# Altium project Project.PrjPCB
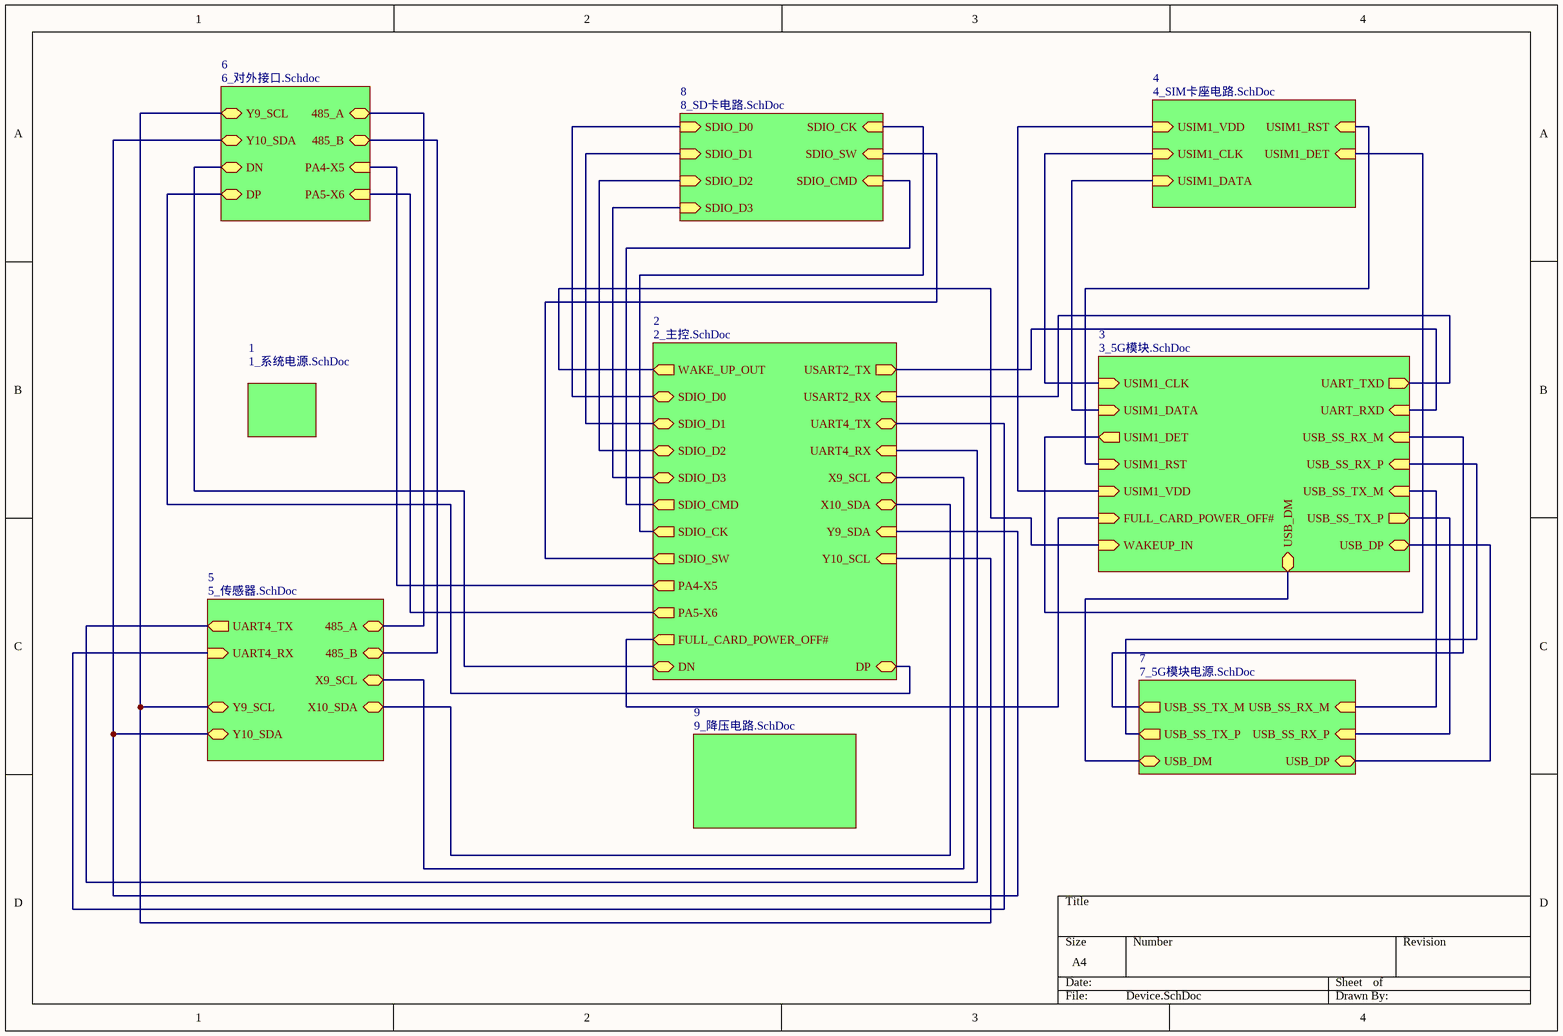
[diagram p0: Device.SchDoc]
9 sheets, 133 parts. Net scope: hierarchical (ports join the sheet entries above them; power ports are global).
Board file: PCB1.PcbDoc
Sheets:
  Device.SchDoc
    2 = 2_主控.SchDoc
    3 = 3_5G模块.SchDoc
    4 = 4_SIM卡座电路.SchDoc
    5 = 5_传感器.SchDoc
    6 = 6_对外接口.Schdoc
    7 = 7_5G模块电源.SchDoc
    8 = 8_SD卡电路.SchDoc
    9 = 9_降压电路.SchDoc

## Sheet Device.SchDoc
size A4

### Sub-sheets
1 = 1_系统电源.SchDoc (file not in this document): no entries
2 = 2_主控.SchDoc: USART2_TX (out), USART2_RX (in), UART4_TX (bidir), UART4_RX (in), X9_SCL (bidir), X10_SDA (bidir), Y9_SDA (in), Y10_SCL (in), PA4-X5 (out), PA5-X6 (out), SDIO_D0 (bidir), SDIO_D1 (bidir), SDIO_D2 (bidir), SDIO_D3 (bidir), SDIO_SW (out), SDIO_CK (out), SDIO_CMD (out), FULL_CARD_POWER_OFF# (out), WAKE_UP_OUT (out), DN (bidir), DP (bidir)
3 = 3_5G模块.SchDoc: USIM1_CLK (in), USIM1_DATA (in), USIM1_DET (out), USIM1_RST (in), USIM1_VDD (in), UART_TXD (out), UART_RXD (in), FULL_CARD_POWER_OFF# (in), USB_SS_RX_M (in), USB_SS_RX_P (in), USB_SS_TX_M (in), USB_SS_TX_P (out), WAKEUP_IN (in), USB_DP (bidir), USB_DM (bidir)
4 = 4_SIM卡座电路.SchDoc: USIM1_VDD (in), USIM1_CLK (in), USIM1_DATA (in), USIM1_RST (in), USIM1_DET (in)
5 = 5_传感器.SchDoc: UART4_TX (out), UART4_RX (in), 485_A (bidir), 485_B (bidir), X9_SCL (bidir), X10_SDA (bidir), Y9_SCL (bidir), Y10_SDA (bidir)
6 = 6_对外接口.Schdoc: Y9_SCL (bidir), Y10_SDA (bidir), 485_A (bidir), 485_B (bidir), PA4-X5 (in), PA5-X6 (in), DN (bidir), DP (bidir)
7 = 7_5G模块电源.SchDoc: USB_SS_TX_M (out), USB_SS_TX_P (out), USB_SS_RX_M (in), USB_SS_RX_P (in), USB_DM (bidir), USB_DP (bidir)
8 = 8_SD卡电路.SchDoc: SDIO_D0 (in), SDIO_D1 (in), SDIO_D2 (in), SDIO_D3 (in), SDIO_CK (in), SDIO_SW (in), SDIO_CMD (in)
9 = 9_降压电路.SchDoc: no entries

### Nets
485_A: sheet 5/485_A, sheet 6/485_A
485_B: sheet 5/485_B, sheet 6/485_B
DN: sheet 2/DN, sheet 6/DN
DP: sheet 2/DP, sheet 6/DP
FULL_CARD_POWER_OFF#: sheet 2/FULL_CARD_POWER_OFF#, sheet 3/FULL_CARD_POWER_OFF#
PA4-X5: sheet 2/PA4-X5, sheet 6/PA4-X5
PA5-X6: sheet 2/PA5-X6, sheet 6/PA5-X6
SDIO_CK: sheet 2/SDIO_CK, sheet 8/SDIO_CK
SDIO_CMD: sheet 2/SDIO_CMD, sheet 8/SDIO_CMD
SDIO_D0: sheet 2/SDIO_D0, sheet 8/SDIO_D0
SDIO_D1: sheet 2/SDIO_D1, sheet 8/SDIO_D1
SDIO_D2: sheet 2/SDIO_D2, sheet 8/SDIO_D2
SDIO_D3: sheet 2/SDIO_D3, sheet 8/SDIO_D3
SDIO_SW: sheet 2/SDIO_SW, sheet 8/SDIO_SW
UART4_RX: sheet 2/UART4_RX, sheet 5/UART4_TX
UART4_TX: sheet 2/UART4_TX, sheet 5/UART4_RX
UART_RXD: sheet 2/USART2_TX, sheet 3/UART_RXD
UART_TXD: sheet 2/USART2_RX, sheet 3/UART_TXD
USB_DM: sheet 3/USB_DM, sheet 7/USB_DM
USB_DP: sheet 3/USB_DP, sheet 7/USB_DP
USB_SS_RX_M: sheet 3/USB_SS_RX_M, sheet 7/USB_SS_TX_M
USB_SS_RX_P: sheet 3/USB_SS_RX_P, sheet 7/USB_SS_TX_P
USB_SS_TX_M: sheet 3/USB_SS_TX_M, sheet 7/USB_SS_RX_M
USB_SS_TX_P: sheet 3/USB_SS_TX_P, sheet 7/USB_SS_RX_P
USIM1_CLK: sheet 3/USIM1_CLK, sheet 4/USIM1_CLK
USIM1_DATA: sheet 3/USIM1_DATA, sheet 4/USIM1_DATA
USIM1_DET: sheet 3/USIM1_DET, sheet 4/USIM1_DET
USIM1_RST: sheet 3/USIM1_RST, sheet 4/USIM1_RST
USIM1_VDD: sheet 3/USIM1_VDD, sheet 4/USIM1_VDD
WAKE_UP_OUT: sheet 2/WAKE_UP_OUT, sheet 3/WAKEUP_IN
X9_SCL: sheet 2/X9_SCL, sheet 5/X9_SCL
X10_SDA: sheet 2/X10_SDA, sheet 5/X10_SDA
Y10_SCL: sheet 2/Y10_SCL, sheet 5/Y9_SCL, sheet 6/Y9_SCL
Y10_SDA: sheet 2/Y9_SDA, sheet 5/Y10_SDA, sheet 6/Y10_SDA

## Sheet 2_主控.SchDoc
size A3
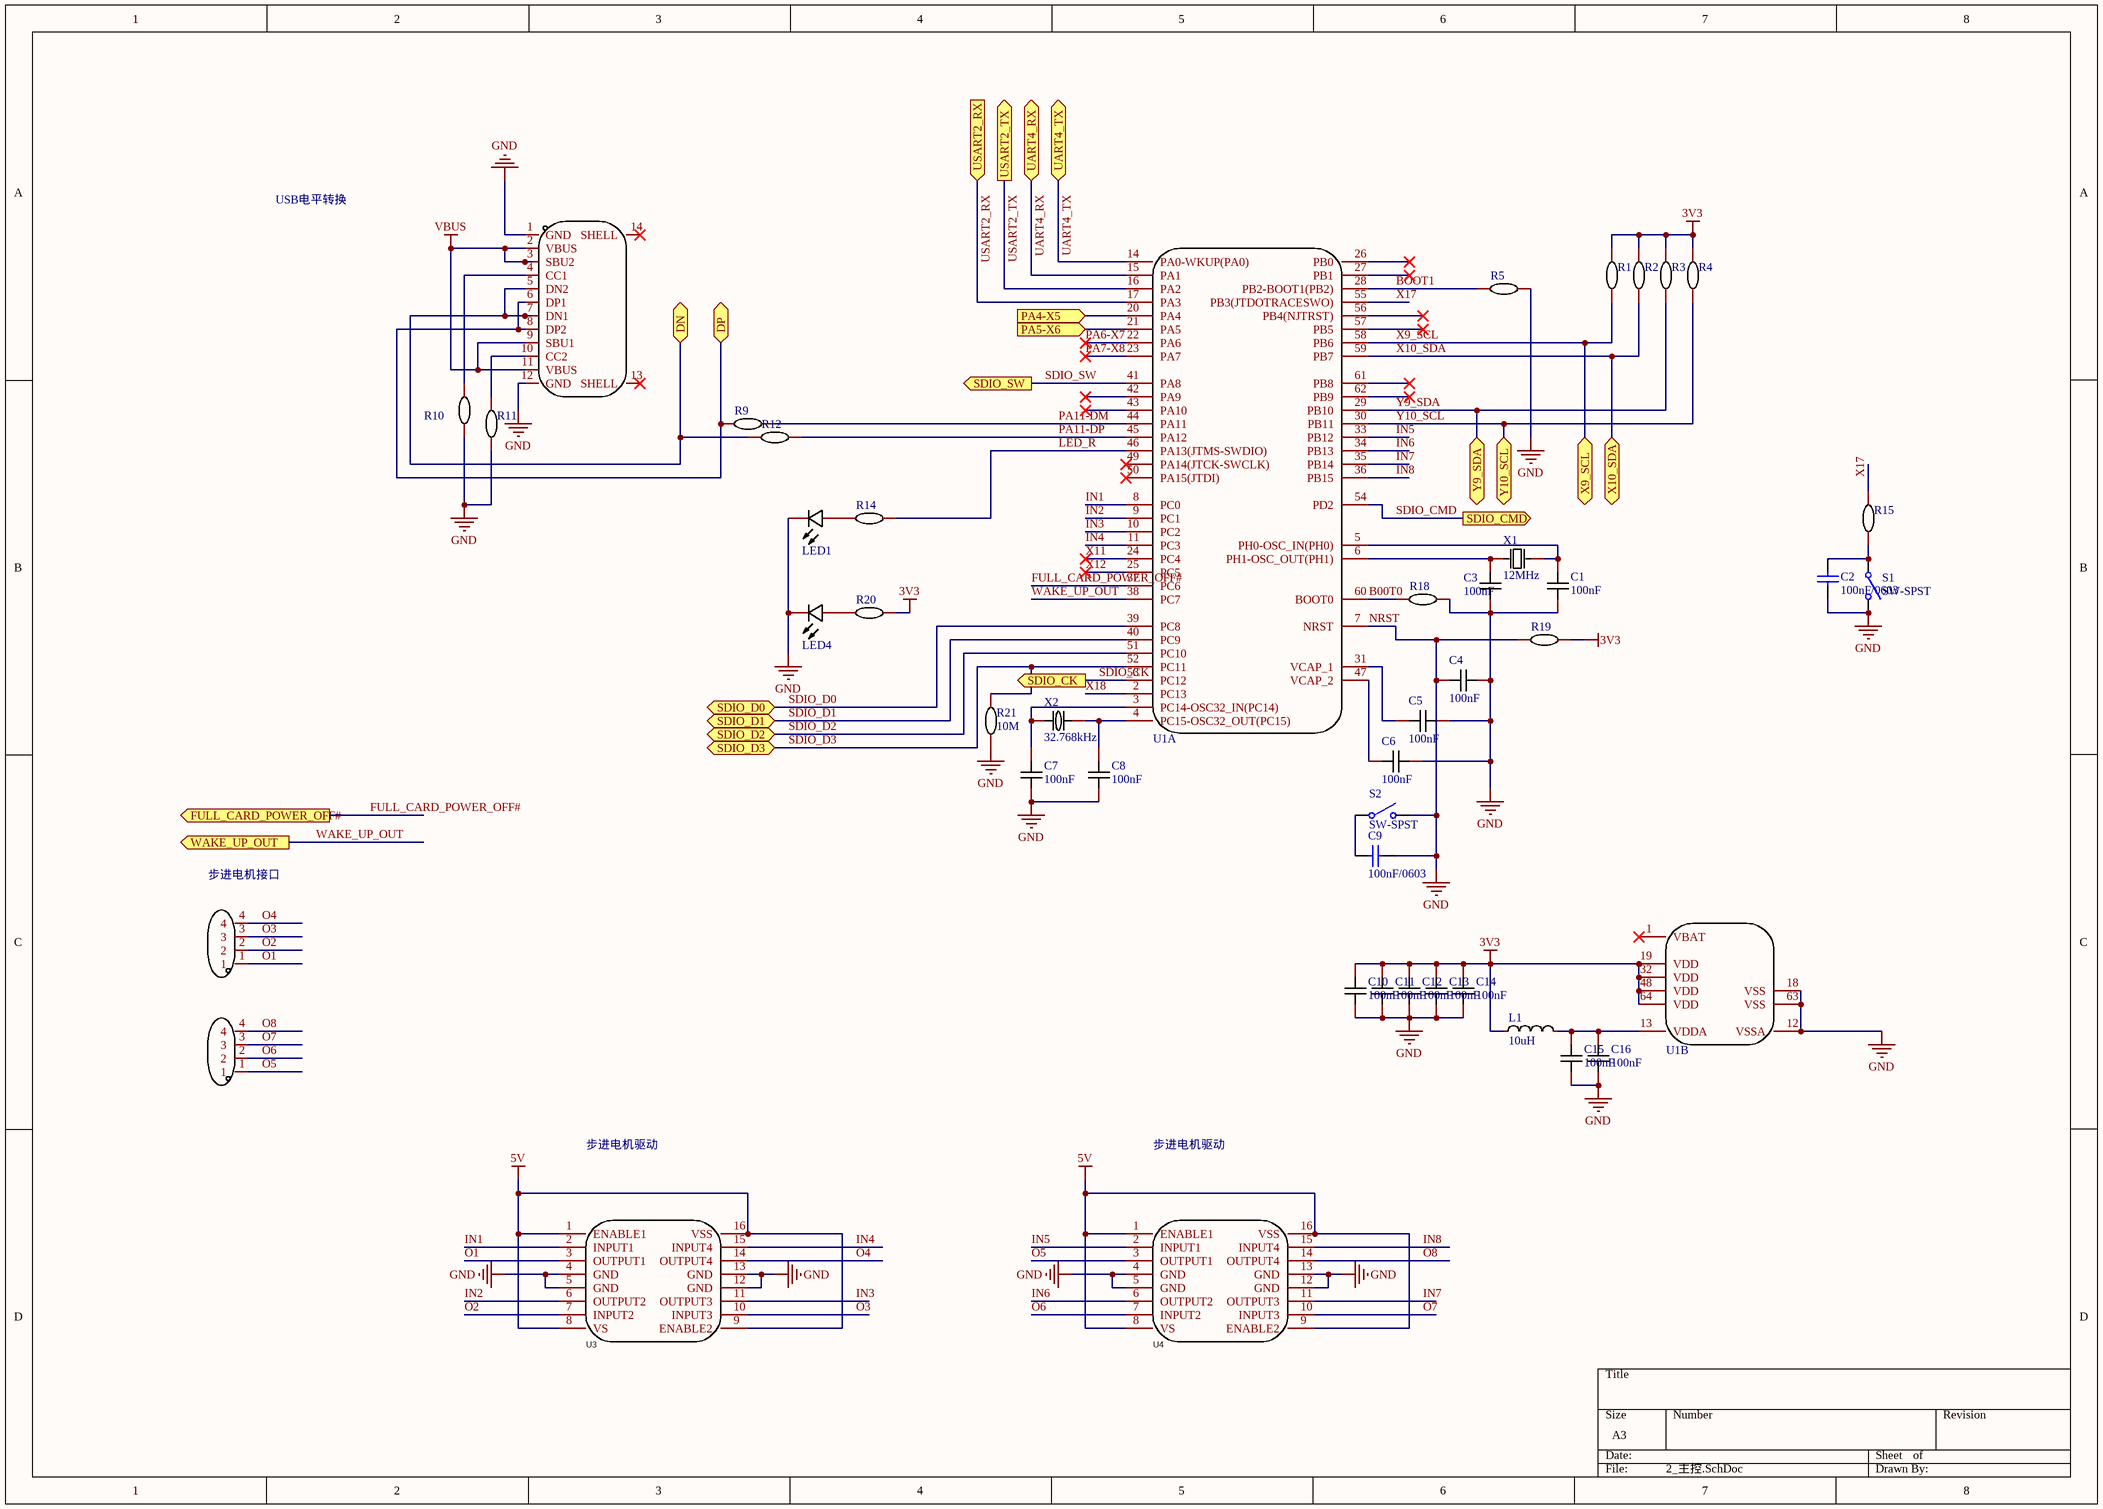
[diagram p1: 2_主控.SchDoc]

### Parts
C1  100nF  [0603C]
C2  100nF/0603  [0603C]
C3  100nF  [0603C]
C4  100nF  [0603C]
C5  100nF  [0603C]
C6  100nF  [0603C]
C7  100nF  [0603C]
C8  100nF  [0603C]
C9  100nF/0603  [0603C]
C10  100nF  [0402C]
C11  100nF  [0402C]
C12  100nF  [0402C]
C13  100nF  [0402C]
C14  100nF  [0402C]
C15  100nF  [0402C]
C16  100nF  [0402C]
CN1  HC-XHB-4A  [CONN-TH_4P-P2.50_HCTL_HC-XHB-4A]  (value not drawn)
CN2  HC-XHB-4A  [CONN-TH_4P-P2.50_HCTL_HC-XHB-4A]  (value not drawn)
L1  10uH  [L0603]
LED1  19-217/BHC-ZL1M2RY/3T  [LED0603-R-RD]  (value not drawn)
LED4  19-217/BHC-ZL1M2RY/3T  [LED0603-R-RD]  (value not drawn)
R1  (no value)  [0402R]
R2  (no value)  [0402R]
R3  (no value)  [0402R]
R4  (no value)  [0402R]
R5  (no value)  [0402R]
R9  (no value)  [0402R]
R10  (no value)  [0402R]
R11  (no value)  [0402R]
R12  (no value)  [0402R]
R14  (no value)  [0402R]
R15  (no value)  [0402R]
R18  (no value)  [0402R]
R19  (no value)  [0402R]
R20  (no value)  [0402R]
R21  10M  [0603R]
S1  SW-SPST  [SW-3x6mm-SMT]
S2  SW-SPST  [SW-3x6mm-SMT]
U1  STM32F405RGT6  [LQFP-64_L10.0-W10.0-P0.50-LS12.0-BL]  (value not drawn)  (parts A,B of 2)
U3  L293D  [SOIC-20_L13.0-W7.6-P1.27-LS10.3-BL]  (value not drawn)
U4  L293D  [SOIC-20_L13.0-W7.6-P1.27-LS10.3-BL]  (value not drawn)
USB1  TYPE-C 16PIN 2MD(073)  [USB-C-SMD_TYPE-C-6PIN-2MD-073]  (value not drawn)
X1  12MHz  [CRYSTAL-SMD_L5.0-W3.2]
X2  32.768kHz  [FC-135R_L3.2-W1.5]

### Ports
DN (bidir), DP (bidir), FULL_CARD_POWER_OFF# (out), PA4-X5 (in), PA5-X6 (in), SDIO_CK (out), SDIO_CMD (out), SDIO_D0 (bidir), SDIO_D1 (bidir), SDIO_D2 (bidir), SDIO_D3 (bidir), SDIO_SW (out), UART4_RX (bidir), UART4_TX (bidir), USART2_RX (in), USART2_TX (out), WAKE_UP_OUT (out), X9_SCL (bidir), X10_SDA (bidir), Y9_SDA (bidir), Y10_SCL (bidir)

### Nets
3V3: C10.2 C11.2 C12.2 C13.2 C14.2 L1.1 R1.2 R2.2 R3.2 R4.2 R19.1 R20.1 U1.19(VDD) U1.32(VDD) U1.48(VDD) U1.64(VDD)
5V: U3.1(ENABLE1) U3.8(VS) U3.9(ENABLE2) U3.16(VSS) U4.1(ENABLE1) U4.8(VS) U4.9(ENABLE2) U4.16(VSS)
GND: C1.1 C2.2 C3.1 C4.1 C4.2 C5.1 C6.1 C7.1 C8.1 C9.2 C10.1 C11.1 C12.1 C13.1 C14.1 C15.1 C16.1 LED1.2(C) LED4.2(C) R5.2 R10.1 R11.1 R18.1 R19.2 R21.1 S1.2(NO) S2.2(NO) U1.7(NRST) U1.12(VSSA) U1.18(VSS) U1.63(VSS) U3.4(GND) U3.5(GND) U3.12(GND) U3.13(GND) U4.4(GND) U4.5(GND) U4.12(GND) U4.13(GND) USB1.1(GND) USB1.12(GND)  [also labelled NRST]
VBUS: USB1.2(VBUS) USB1.3(SBU2) USB1.9(SBU1) USB1.11(VBUS)
B00T0: R18.2 U1.60(BOOT0)
BOOT1: R5.1 U1.28(PB2-BOOT1(PB2))
DN: R12.2 USB1.5(DN2) USB1.7(DN1) ; port DN
DP: R9.2 USB1.6(DP1) USB1.8(DP2) ; port DP
FULL_CARD_POWER_OFF#: U1.37(PC6) ; port FULL_CARD_POWER_OFF#
IN1: U1.8(PC0) U3.2(INPUT1)
IN2: U1.9(PC1) U3.6(OUTPUT2)
IN3: U1.10(PC2) U3.11(OUTPUT3)
IN4: U1.11(PC3) U3.15(INPUT4)
IN5: U1.33(PB12) U4.2(INPUT1)
IN6: U1.34(PB13) U4.6(OUTPUT2)
IN7: U1.35(PB14) U4.11(OUTPUT3)
IN8: U1.36(PB15) U4.15(INPUT4)
LED_R: R14.2 U1.46(PA13(JTMS-SWDIO))
O1: CN1.1 U3.3(OUTPUT1)
O2: CN1.2 U3.7(INPUT2)
O3: CN1.3 U3.10(INPUT3)
O4: CN1.4 U3.14(OUTPUT4)
O5: CN2.1 U4.3(OUTPUT1)
O6: CN2.2 U4.7(INPUT2)
O7: CN2.3 U4.10(INPUT3)
O8: CN2.4 U4.14(OUTPUT4)
PA4-X5: U1.20(PA4) ; port PA4-X5
PA5-X6: U1.21(PA5) ; port PA5-X6
PA6-X7: U1.22(PA6)
PA7-X8: U1.23(PA7)
PA11-DM: R9.1 U1.44(PA11)
PA11-DP: R12.1 U1.45(PA12)
SDIO_CK: U1.53(PC12) ; port SDIO_CK
SDIO_CMD: U1.54(PD2) ; port SDIO_CMD
SDIO_D0: U1.39(PC8) ; port SDIO_D0
SDIO_D1: U1.40(PC9) ; port SDIO_D1
SDIO_D2: U1.51(PC10) ; port SDIO_D2
SDIO_D3: R21.2 U1.52(PC11) ; port SDIO_D3
SDIO_SW: U1.41(PA8) ; port SDIO_SW
UART4_RX: U1.15(PA1) ; port UART4_RX
UART4_TX: U1.14(PA0-WKUP(PA0)) ; port UART4_TX
USART2_RX: U1.17(PA3) ; port USART2_RX  [project net UART_TXD]
USART2_TX: U1.16(PA2) ; port USART2_TX  [project net UART_RXD]
WAKE_UP_OUT: U1.38(PC7) ; port WAKE_UP_OUT
X9_SCL: R1.1 U1.58(PB6) ; port X9_SCL
X10_SDA: R2.1 U1.59(PB7) ; port X10_SDA
X11: U1.24(PC4)
X12: U1.25(PC5)
X17: R15.2 U1.55(PB3(JTDOTRACESWO))
X18: U1.2(PC13)
Y9_SDA: R3.1 U1.29(PB10) ; port Y9_SDA  [project net Y10_SDA]
Y10_SCL: R4.1 U1.30(PB11) ; port Y10_SCL
NetC1_2: C1.2 U1.5(PH0-OSC_IN(PH0)) X1.2(OSC2)
NetC2_1: C2.1 R15.1 S1.1(COMMON)
NetC3_2: C3.2 U1.6(PH1-OSC_OUT(PH1)) X1.1(OSC1)
NetC5_2: C5.2 U1.31(VCAP_1)
NetC6_2: C6.2 U1.47(VCAP_2)
NetC7_2: C7.2 U1.3(PC14-OSC32_IN(PC14)) X2.1
NetC8_2: C8.2 U1.4(PC15-OSC32_OUT(PC15)) X2.2
NetC9_1: C9.1 S2.1(COMMON)
NetC15_2: C15.2 C16.2 L1.2 U1.13(VDDA)
NetLED1_1: LED1.1(A) R14.1
NetLED4_1: LED4.1(A) R20.2
NetR10_2: R10.2 USB1.4(CC1)
NetR11_2: R11.2 USB1.10(CC2)

Not connected (* = marked no-connect by the designer): U1 1(VBAT)* 26(PB0)* 27(PB1)* 42(PA9)* 43(PA10)* 49(PA14(JTCK-SWCLK))* 50(PA15(JTDI))* 56(PB4(NJTRST))* 57(PB5)* 61(PB8)* 62(PB9)*; USB1 13(SHELL)* 14(SHELL)*

### Notes on the sheet
- USB电平转换
- (near CN1) 步进电机接口
- 步进电机驱动

### Library data of the parts
C1 C3-C8 C10-C16 = CAP_0603: Symbol: CapAcitance; Convert to PCB: yes; Device: CAP_0603; Add into BOM: yes; Supplier Footprint: 0603; Value: 100nF; Name: 100nF
C2 C9 = Cap: Capacitor; Value: 100pF; Published: 8-Jun-2000; LatestRevisionDate: 17-Jul-2002; LatestRevisionNote: Re-released for DXP Platform.; PackageReference: RAD-0.3; Publisher: Altium Limited; PackageDescription: Radial Cap, Thru-Hole; 2 Leads; 0.3 in Pin Spacing
CN1 CN2 = HC-XHB-4A: Add into BOM: yes; Pins Structure: 1x4P; Pitch: 2.5mm; Number of PINs Per Row: 4; Current Rating (Max): 3A; Symbol: HC-XHB-4A; Device: HC-XHB-4A; Supplier: LCSC; Supplier Part: C2845492; Manufacturer Part: HC-XHB-4A; JLCPCB Part Class: Extended Part; Datasheet: https://atta.szlcsc.com/upload/public/pdf/source/20230711/94C5BFB4D0A0F292EDF07DDE5BFB6378.pdf; Convert to PCB: yes; Row Spacing: -; Number of Pins: 4P; Number of Rows: 1; Reference Series: -
L1 = L_0603: Symbol: SDFL1608S100KTF; Add into BOM: yes; Device: L_0603; Supplier Footprint: L0603; Convert to PCB: yes; Value: 10uH; Name: 10uH
LED1 LED4 = 19-217/BHC-ZL1M2RY/3T: Add into BOM: yes; Luminous Intensity (IF=20mA): 11.5~28.5mcd@5mA; Dominant Wavelength / Coordinate rank: 465~475nm; Symbol: 19-217/BHC-ZL1M2RY/3T; Device: 19-217/BHC-ZL1M2RY/3T; Supplier Part: C72041; Manufacturer Part: 19-217/BHC-ZL1M2RY/3T; Supplier Footprint: 0603; JLCPCB Part Class: Basic Part; Datasheet: https://atta.szlcsc.com/upload/public/pdf/source/20170116/1484561237273.pdf; Supplier: LCSC; Convert to PCB: yes; Name: 19-217/BHC-ZL1M2RY/3T
R1-R5 R9-R12 R14 R15 R18-R20 = RC0402FR-0710KL: Add into BOM: yes; Power(Watts): 62.5mW; Overload Voltage (Max): 50V; Device: RC0402FR-0710KL; Supplier Part: C60490; Manufacturer Part: RC0402FR-0710KL; Supplier Footprint: 0402; JLCPCB Part Class: Extended Part; Datasheet: https://atta.szlcsc.com/upload/public/pdf/source/20170606/1496716515432.pdf; Supplier: LCSC; Convert to PCB: yes
R21 = Res_0603: Convert to PCB: yes; Device: Res_0603; Add into BOM: yes; Supplier Footprint: 0603; Value: 10M; Name: 10M
S1 S2 = SW-SPST: Single-Pole, Single-Throw Switch; Published: 24-Mar-1999; LatestRevisionDate: 17-Jul-2002; LatestRevisionNote: Re-released for DXP Platform.; PackageReference: SPST-2; Publisher: Altium Limited
U1 = STM32F405RGT6: Add into BOM: yes; CPU Core: ARM Cortex-M4; Maximum Frequency: 168MHz; Supply Voltage Range: 1.8V~3.6V; Program FLASH Size: 1MB; RAM Size: 192KB; GPIO Ports Number: 51; ADC (Units/Channels/bits): 1@x16ch/12bit; DAC (Units/Channels/bits): 1@x2ch/12bit; Symbol: STM32F405RGT6; Device: STM32F405RGT6; Supplier Part: C15742; Manufacturer Part: STM32F405RGT6; Supplier Footprint: LQFP-64(10x10); JLCPCB Part Class: Extended Part; Datasheet: https://atta.szlcsc.com/upload/public/pdf/source/20140724/1457707160365.pdf; Supplier: LCSC; Convert to PCB: yes; EEPROM/Data FLASH Size: -; Name: STM32F405RGT6
U3 U4 = L293D: Add into BOM: yes; Supply Voltage: 4.5V~36V; Output Current: 600mA; Symbol: L293D; Device: L293D; Supplier Part: C12340; Manufacturer Part: L293D; Supplier Footprint: DIP-16; JLCPCB Part Class: Extended Part; Datasheet: https://atta.szlcsc.com/upload/public/pdf/source/20140724/1457707157802.pdf; Supplier: LCSC; Convert to PCB: yes
USB1 = TYPE-C 16PIN 2MD(073): Add into BOM: yes; Number of Ports: 1; Number of Contacts: 16P; Current Rating - Power (Max): 5A; Symbol: TYPE-C 16PIN 2MD(073); Device: TYPE-C 16PIN 2MD(073); Supplier: LCSC; Supplier Part: C2765186; Manufacturer Part: TYPE-C 16PIN 2MD(073); JLCPCB Part Class: Extended Part; Supplier Footprint: SMD; Datasheet: https://atta.szlcsc.com/upload/public/pdf/source/20211123/39B17C16241EAC15C5E277BDA434118E.pdf; Convert to PCB: yes; Connector Type: Type-C; Standard: -
X1 = X50328MSB2GI: Add into BOM: yes; Load Capacitance: 20pF; Symbol: X50328MSB2GI; Device: X50328MSB2GI; Supplier Part: C115962; Manufacturer Part: X50328MSB2GI; Supplier Footprint: SMD5032-2P; JLCPCB Part Class: Basic Part; Datasheet: https://atta.szlcsc.com/upload/public/pdf/source/20230220/0EBFFB9D6D8CE6A211407822BBB6C516.pdf; Supplier: LCSC; Convert to PCB: yes; Value: 12MHz; Name: 12MHz
X2 = Q13FC1350000400: Add into BOM: yes; Load Capacitance: 12.5pF; Symbol: Q13FC1350000400; Device: Q13FC1350000400; Supplier Part: C32346; Manufacturer Part: Q13FC1350000400; Supplier Footprint: SMD3215-2P; JLCPCB Part Class: Basic Part; Datasheet: https://atta.szlcsc.com/upload/public/pdf/source/20190108/C32346_746D6B07EAF90824457A96480007685F.pdf; Supplier: LCSC; Convert to PCB: yes; Value: 32.768kHz; Name: 32.768kHz

## Sheet 3_5G模块.SchDoc
size A4
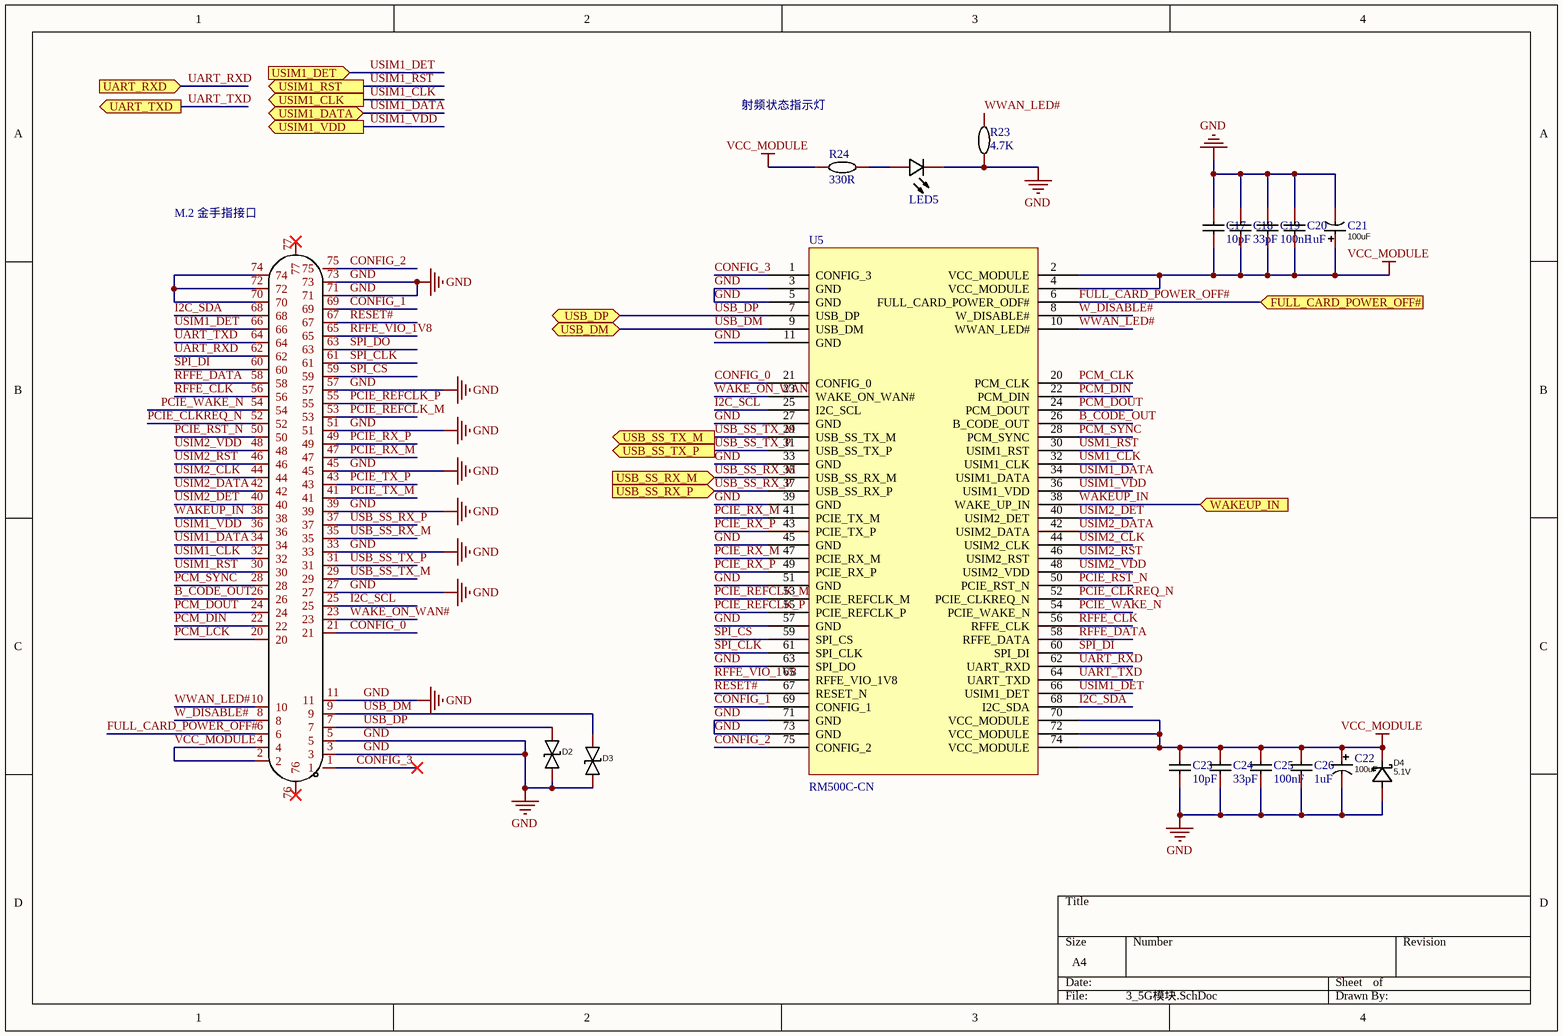
[diagram p2: 3_5G模块.SchDoc]

### Parts
C17  Name: 10pF  [0603C]  (hidden comment: 100nF)
C18  Name: 33pF  [0603C]  (hidden comment: 100nF)
C19  100nF  [0603C]
C20  Name: 1uF  [0603C]  (hidden comment: 100nF)
C21  100uF  [1206C]
C22  100uF  [1206C]
C23  Name: 10pF  [0603C]  (hidden comment: 100nF)
C24  Name: 33pF  [0603C]  (hidden comment: 100nF)
C25  100nF  [0603C]
C26  Name: 1uF  [0603C]  (hidden comment: 100nF)
CN3  APCI0078-P002A_C7498136  [NGFF-SMD_APCI0078-P002A]  (value not drawn)
D2  PESD3V3L1BA-N  [SOD-323_L1.8-W1.3-LS2.5-BI]  (value not drawn)
D3  PESD3V3L1BA-N  [SOD-323_L1.8-W1.3-LS2.5-BI]  (value not drawn)
D4  Reverse Stand-Off Voltage (Vrwm): 5.1V  [SOD-123FL_L2.8-W1.8-LS3.7-RD]  (hidden comment: SMF75A_C5116416)
LED5  NCD0603G1  [LED0603-RD]  (value not drawn)
R23  4.7K  [0603R]
R24  330R  [0402R]
U5  RM500C-CN

### Ports
FULL_CARD_POWER_OFF# (in), UART_RXD (in), UART_TXD (out), USB_DM (bidir), USB_DP (bidir), USB_SS_RX_M (in), USB_SS_RX_P (in), USB_SS_TX_M (out), USB_SS_TX_P (out), USIM1_CLK (out), USIM1_DATA (bidir), USIM1_DET (in), USIM1_RST (out), USIM1_VDD (out), WAKEUP_IN (in)

### Nets
GND: C17.1 C18.1 C19.1 C20.1 C21.2 C22.2 C23.1 C24.1 C25.1 C26.1 CN3.3 CN3.5 CN3.11 CN3.27 CN3.33 CN3.39 CN3.45 CN3.51 CN3.57 CN3.71 CN3.73 D2.1 D3.1 D4.2(A) LED5.1(C) R23.1 U5.3(GND) U5.5(GND) U5.11(GND) U5.27(GND) U5.33(GND) U5.39(GND) U5.45(GND) U5.51(GND) U5.57(GND) U5.63(SPI_DO) U5.71(GND) U5.73(GND)
VCC_MODULE: C17.2 C18.2 C19.2 C20.2 C21.1 C22.1 C23.2 C24.2 C25.2 C26.2 CN3.2 CN3.4 D4.1(K) R24.1 U5.2(VCC_MODULE) U5.4(VCC_MODULE) U5.70(VCC_MODULE) U5.72(VCC_MODULE) U5.74(VCC_MODULE)
B_CODE_OUT: CN3.26 U5.26(B_CODE_OUT)
CONFIG_0: CN3.21 U5.21(CONFIG_0)
CONFIG_1: CN3.69 U5.69(CONFIG_1)
CONFIG_2: CN3.75 U5.75(CONFIG_2)
CONFIG_3: CN3.1 U5.1(CONFIG_3)
FULL_CARD_POWER_OFF#: CN3.6 U5.6(FULL_CARD_POWER_ODF#) ; port FULL_CARD_POWER_OFF#
I2C_SCL: CN3.25 U5.25(I2C_SCL)
I2C_SDA: CN3.68 U5.68(I2C_SDA)
PCIE_CLKREQ_N: CN3.52 U5.52(PCIE_CLKREQ_N)
PCIE_REFCLK_M: CN3.53 U5.53(PCIE_REFCLK_M)
PCIE_REFCLK_P: CN3.55 U5.55(PCIE_REFCLK_P)
PCIE_RST_N: CN3.50 U5.50(PCIE_RST_N)
PCIE_RX_M: CN3.47 U5.41(PCIE_TX_M) U5.47(PCIE_RX_M)
PCIE_RX_P: CN3.49 U5.43(PCIE_TX_P) U5.49(PCIE_RX_P)
PCIE_TX_M: CN3.41
PCIE_TX_P: CN3.43
PCIE_WAKE_N: CN3.54 U5.54(PCIE_WAKE_N)
PCM_CLK: U5.20(PCM_CLK)
PCM_DIN: CN3.22 U5.22(PCM_DIN)
PCM_DOUT: CN3.24 U5.24(PCM_DOUT)
PCM_LCK: CN3.20
PCM_SYNC: CN3.28 U5.28(PCM_SYNC)
RESET#: CN3.67 U5.67(RESET_N)
RFFE_CLK: CN3.56 U5.56(RFFE_CLK)
RFFE_DATA: CN3.58 U5.58(RFFE_DATA)
RFFE_VIO_1V8: CN3.65 U5.65(RFFE_VIO_1V8)
SPI_CLK: CN3.61 U5.61(SPI_CLK)
SPI_CS: CN3.59 U5.59(SPI_CS)
SPI_DI: CN3.60 U5.60(SPI_DI)
SPI_DO: CN3.63
UART_RXD: CN3.62 U5.62(UART_RXD) ; port UART_RXD
UART_TXD: CN3.64 U5.64(UART_TXD) ; port UART_TXD
USB_DM: CN3.9 D3.2 U5.9(USB_DM) ; port USB_DM
USB_DP: CN3.7 D2.2 U5.7(USB_DP) ; port USB_DP
USB_SS_RX_M: CN3.35 U5.35(USB_SS_RX_M) ; port USB_SS_RX_M
USB_SS_RX_P: CN3.37 U5.37(USB_SS_RX_P) ; port USB_SS_RX_P
USB_SS_TX_M: CN3.29 U5.29(USB_SS_TX_M) ; port USB_SS_TX_M
USB_SS_TX_P: CN3.31 U5.31(USB_SS_TX_P) ; port USB_SS_TX_P
USIM1_CLK: CN3.32 ; port USIM1_CLK
USIM1_DATA: CN3.34 U5.34(USIM1_DATA) ; port USIM1_DATA
USIM1_DET: CN3.66 U5.66(USIM1_DET) ; port USIM1_DET
USIM1_RST: CN3.30 ; port USIM1_RST
USIM1_VDD: CN3.36 U5.36(USIM1_VDD) ; port USIM1_VDD
USIM2_CLK: CN3.44 U5.44(USIM2_CLK)
USIM2_DATA: CN3.42 U5.42(USIM2_DATA)
USIM2_DET: CN3.40 U5.40(USIM2_DET)
USIM2_RST: CN3.46 U5.46(USIM2_RST)
USIM2_VDD: CN3.48 U5.48(USIM2_VDD)
USM1_CLK: U5.32(USIM1_CLK)
USM1_RST: U5.30(USIM1_RST)
W_DISABLE#: CN3.8 U5.8(W_DISABLE#)
WAKE_ON_WAN#: CN3.23 U5.23(WAKE_ON_WAN#)
WAKEUP_IN: CN3.38 U5.38(WAKE_UP_IN) ; port WAKEUP_IN  [project net WAKE_UP_OUT]
WWAN_LED#: CN3.10 R23.2 U5.10(WWAN_LED#)
NetCN3_70: CN3.70 CN3.72 CN3.74
NetLED5_2: LED5.2(A) R24.2

Not connected (* = marked no-connect by the designer): CN3 76* 77*

### Notes on the sheet
- 射频状态指示灯
- (near CN3) M.2 金手指接口

### Library data of the parts
C17-C20 C23-C26 = 0603B104K500NT: Manufacturer: FH; Convert to PCB: yes; Origin Footprint: C0603; Symbol: 100nF; Device: 0603B104K500NT; Supplier: LCSC; Manufacturer Part: 0603B104K500NT; Supplier Part: C30926; JLCPCB Part Class: Extended Part; Add into BOM: yes
  C19 C25: Name: 100nF
C21 C22 = CL31A226KAHNNNE: Symbol: 22uF; Add into BOM: yes; Temperature Coefficient: X5R; Voltage Rated: 25V; Origin Footprint: CAP-TH_BD4.0-P1.50-D0.8-FD; Device: CL31A226KAHNNNE; Supplier Part: C12891; Manufacturer Part: CL31A226KAHNNNE; Supplier Footprint: 1206; JLCPCB Part Class: Extended Part; Datasheet: https://atta.szlcsc.com/upload/public/pdf/source/20160103/1457707667836.pdf; Supplier: LCSC; Convert to PCB: yes; Value: 100uF
CN3 = APCI0078-P002A_C7498136: Add into BOM: yes; Connector Type: M.2; Pitch: 0.5mm; Symbol: APCI0078-P002A_C7498136; Device: APCI0078-P002A_C7498136; Supplier: LCSC; Supplier Part: C7498136; Manufacturer Part: APCI0078-P002A; JLCPCB Part Class: Extended Part; Datasheet: https://atta.szlcsc.com/upload/public/pdf/source/20230918/968CC5EFA479112182B1AF662CC27BAA.pdf; Convert to PCB: yes; Number of Pins: 67P; Height Above Board: 3.2mm
D2 D3 = PESD3V3L1BA-N: Add into BOM: yes; Symbol: PESD3V3L1BA-N; Device: PESD3V3L1BA-N; Supplier: LCSC; Supplier Part: C316020; Manufacturer Part: PESD3V3L1BA-N; JLCPCB Part Class: Extended Part; LCSC Part Name: PESD3V3L1BA-N; Supplier Footprint: SOD-323; Datasheet: https://atta.szlcsc.com/upload/public/pdf/source/20181025/C316020_2B145715011D530A3B5DDCE0F9684BA2.pdf; Convert to PCB: yes
D4 = SMF75A_C5116416: Manufacturer Part: SMF75A; Add into BOM: yes; Maximum Clamping Voltage: 121V; Peak Pulse Current (Ipp)@10/1000us: 1.4A; Peak Pulse Power Dissipation (Ppp)@10/1000us: 200W; Breakdown Voltage: 92.1V; Reverse Leakage Current (Ir): 1uA; Symbol: SMF75A_C5116416; Device: SMF75A_C5116416; Supplier Part: C5116416; Supplier Footprint: SOD-123FL; JLCPCB Part Class: Extended Part; Datasheet: https://atta.szlcsc.com/upload/public/pdf/source/20220715/82D6503F9C43F0DF9BB8970EC229759F.pdf; Convert to PCB: yes
LED5 = NCD0603G1: Symbol: 19-217/GHC-YR1S2/3T; Add into BOM: yes; Luminous Intensity (IF=20mA): 300~900mcd@10mA; Dominant Wavelength / Coordinate rank: 515~530nm; Dominant Wavelength: 520nm~535nm; Peak Wavelength: 518nm; Forward Current: 20mA; Power Dissipation: 110mW; Device: NCD0603G1; Supplier Part: C84267; Manufacturer Part: NCD0603G1; Supplier Footprint: 0603; JLCPCB Part Class: Extended Part; Datasheet: https://atta.szlcsc.com/upload/public/pdf/source/20200820/C84267_04BA7703640BAC111D09F5EFB971FBF3.pdf; Supplier: LCSC; Convert to PCB: yes; Correlated Color Temperature - CCT(K): -; Luminous Flux/Radiant Flux: -; Diode Configuration: -; Color Temperature: -; Mounting Sytle: -; Name: NCD0603G1
R23 = RMC06034.7k5%N: Manufacturer: Tyohm; Convert to PCB: yes; Origin Footprint: R0603; Symbol: 4.7K; Device: RMC06034.7k5%N; Supplier: LCSC; Supplier Part: C269694; Manufacturer Part: RMC06034.7k5%N; JLCPCB Part Class: Extended Part; Add into BOM: yes; Name: 4.7K
R24 = 0402WGF1001TCE: Add into BOM: yes; Power(Watts): 62.5mW; Overload Voltage (Max): 50V; Device: 0402WGF1001TCE; Manufacturer Part: 0402WGF1001TCE; Supplier Footprint: 0402; JLCPCB Part Class: Basic Part; Datasheet: https://atta.szlcsc.com/upload/public/pdf/source/20200306/C422600_1E6D84923E4A46A82E41ADD87F860B5C.pdf; Supplier: LCSC; Convert to PCB: yes
U5 = RM500C: id: U?; 注释: RM500C-CN

## Sheet 4_SIM卡座电路.SchDoc
size A4
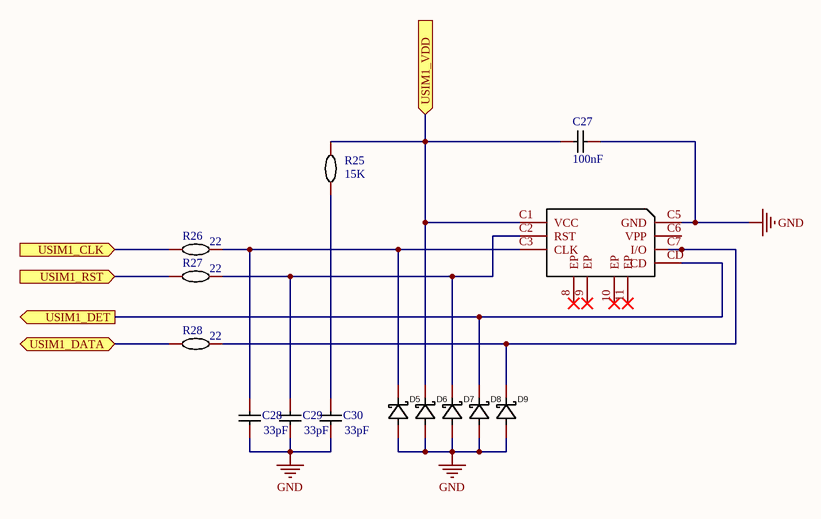
[diagram p3: 4_SIM卡座电路.SchDoc]

### Parts
C27  100nF  [0603C]
C28  33pF  [0402C]
C29  33pF  [0402C]
C30  33pF  [0402C]
CARD1  SMN-303  [SIM-SMD_SMN-303]  (value not drawn)
D5  (no value)  [SOD-123FL_L2.8-W1.8-LS3.7-RD]
D6  (no value)  [SOD-123FL_L2.8-W1.8-LS3.7-RD]
D7  (no value)  [SOD-123FL_L2.8-W1.8-LS3.7-RD]
D8  (no value)  [SOD-123FL_L2.8-W1.8-LS3.7-RD]
D9  (no value)  [SOD-123FL_L2.8-W1.8-LS3.7-RD]
R25  Name: 15K  [0603R]  (hidden comment: 4.7K)
R26  22  [0402R]
R27  22  [0402R]
R28  22  [0402R]

### Ports
USIM1_CLK (in), USIM1_DATA (bidir), USIM1_DET (out), USIM1_RST (in), USIM1_VDD (in)

### Nets
GND: C27.1 C28.1 C29.1 C30.1 CARD1.C5(GND) D5.2(A) D6.2(A) D7.2(A) D8.2(A) D9.2(A)
USIM1_CLK: R26.1 ; port USIM1_CLK
USIM1_DATA: R28.1 ; port USIM1_DATA
USIM1_DET: CARD1.CD D8.1(K) ; port USIM1_DET
USIM1_RST: R27.1 ; port USIM1_RST
USIM1_VDD: C27.2 CARD1.C1(VCC) D6.1(K) R25.2 ; port USIM1_VDD
NetC28_2: C28.2 CARD1.C3(CLK) D5.1(K) R26.2
NetC29_2: C29.2 CARD1.C2(RST) D7.1(K) R27.2
NetC30_2: C30.2 R25.1
NetCARD1_C7: CARD1.C7(I/O) D9.1(K) R28.2

Not connected (* = marked no-connect by the designer): CARD1 8(EP)* 9(EP)* 10(EP)* 11(EP)* C6(VPP)

### Library data of the parts
C27-C30 = CL31A106KBHNNNE: Add into BOM: yes; Value: 10uF; Voltage Rated: 50V; Temperature Coefficient: X5R; Symbol: CL31A106KBHNNNE; Device: CL31A106KBHNNNE; Supplier Part: C13585; Manufacturer Part: CL31A106KBHNNNE; Supplier Footprint: 1206; JLCPCB Part Class: Basic Part; Datasheet: https://atta.szlcsc.com/upload/public/pdf/source/20160103/1457707668742.pdf; Supplier: LCSC; Convert to PCB: yes; Name: 10uF
CARD1 = SMN-303: Add into BOM: yes; Body Height (Max): 1.37mm; Symbol: SMN-303; Device: SMN-303; Supplier: LCSC; Supplier Part: C266888; Manufacturer Part: SMN-303; JLCPCB Part Class: Extended Part; Supplier Footprint: SMD; Datasheet: https://atta.szlcsc.com/upload/public/pdf/source/20230608/69FA23A73293DEADC31E393DD83871F4.pdf; Convert to PCB: yes; Contact Material: C5191
D5-D9 = SMF75A_C5116416: Manufacturer Part: SMF75A; Add into BOM: yes; Reverse Stand-Off Voltage (Vrwm): 75V; Maximum Clamping Voltage: 121V; Peak Pulse Current (Ipp)@10/1000us: 1.4A; Peak Pulse Power Dissipation (Ppp)@10/1000us: 200W; Breakdown Voltage: 92.1V; Reverse Leakage Current (Ir): 1uA; Symbol: SMF75A_C5116416; Device: SMF75A_C5116416; Supplier: LCSC; Supplier Part: C5116416; Supplier Footprint: SOD-123FL; JLCPCB Part Class: Extended Part; Datasheet: https://atta.szlcsc.com/upload/public/pdf/source/20220715/82D6503F9C43F0DF9BB8970EC229759F.pdf; Convert to PCB: yes
R25 = RMC06034.7k5%N: as R23 on sheet 3_5G模块; Symbol: 4.7K; Device: RMC06034.7k5%N; Supplier: LCSC; Supplier Part: C269694; Manufacturer Part: RMC06034.7k5%N; JLCPCB Part Class: Extended Part; Add into BOM: yes
R26-R28 = Res_0402: Convert to PCB: yes; Value: 20; Device: Res_0402; Add into BOM: yes; Supplier Footprint: 0402; Name: 20

## Sheet 5_传感器.SchDoc
size A4
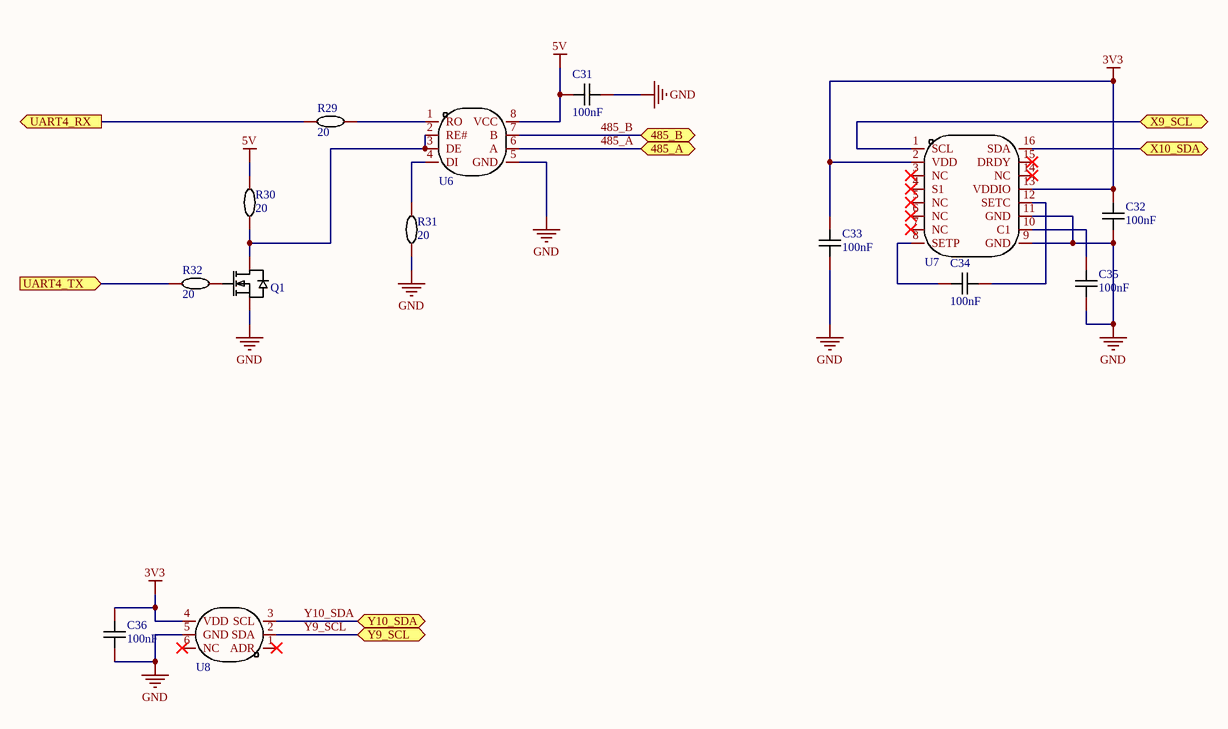
[diagram p4: 5_传感器.SchDoc]

### Parts
C31  100nF  [0402C]
C32  100nF  [0402C]
C33  100nF  [0402C]
C34  100nF  [0402C]
C35  100nF  [0402C]
C36  100nF  [0402C]
Q1  2N7002  [SOT-23-3_L2.9-W1.3-P1.90-LS2.4-BR]  (value not drawn)
R29  20  [0402R]
R30  20  [0402R]
R31  20  [0402R]
R32  20  [0402R]
U6  MAX3485ECSA+  [SOIC-8_L4.9-W3.9-P1.27-LS6.0-BL]  (value not drawn)
U7  QMC5883L  [LGA-16_L3.0-W3.0-P0.50-BL_SQ]  (value not drawn)
U8  AHT10  [SENSOR-SMD_AHT10]  (value not drawn)

### Ports
485_A (bidir), 485_B (bidir), UART4_RX (out), UART4_TX (in), X9_SCL (bidir), X10_SDA (bidir), Y9_SCL (bidir), Y10_SDA (bidir)

### Nets
3V3: C32.1 C33.2 C36.1 U7.2(VDD) U7.13(VDDIO) U8.4(VDD)
5V: C31.2 R30.2 U6.8(VCC)
GND: C31.1 C32.2 C33.1 C35.2 C36.2 Q1.2(S) R31.1 U6.5(GND) U7.9(GND) U7.11(GND) U8.5(GND)
485_A: U6.6(A) ; port 485_A
485_B: U6.7(B) ; port 485_B
UART4_RX: R32.1 ; port UART4_TX
UART4_TX: R29.1 ; port UART4_RX
X9_SCL: U7.1(SCL) ; port X9_SCL
X10_SDA: U7.16(SDA) ; port X10_SDA
Y9_SCL: U8.2(SDA) ; port Y9_SCL  [project net Y10_SCL]
Y10_SDA: U8.3(SCL) ; port Y10_SDA
NetC34_1: C34.1 U7.12(SETC)
NetC34_2: C34.2 U7.8(SETP)
NetC35_1: C35.1 U7.10(C1)
NetQ1_3: Q1.3(D) R30.1 U6.2(RE#) U6.3(DE)
NetR29_2: R29.2 U6.1(RO)
NetR31_2: R31.2 U6.4(DI)

Not connected (* = marked no-connect by the designer): Q1 1(G); R32 2; U7 3(NC)* 4(S1)* 5(NC)* 6(NC)* 7(NC)* 14(NC)* 15(DRDY)*; U8 1(ADR)* 6(NC)*

### Library data of the parts
C31-C36 = CAP_0402: Symbol: CapAcitance; Convert to PCB: yes; Device: CAP_0402; Add into BOM: yes; Supplier Footprint: 0402; Value: 100nF; Name: 100nF
Q1 = 2N7002_C8545: Add into BOM: yes; Drain Source Voltage (Vdss): 60V; Continuous Drain Current (Id): 115mA; Power Dissipation (Pd): 200mW; Gate Threshold Voltage (Vgs(th)@Id): 2.5V@250uA; Symbol: 2N7002; Device: 2N7002_C8545; Supplier Part: C8545; Manufacturer Part: 2N7002; Supplier Footprint: SOT-23; JLCPCB Part Class: Basic Part; Datasheet: https://atta.szlcsc.com/upload/public/pdf/source/20170302/1488422688078.pdf; Supplier: LCSC; Convert to PCB: yes; Name: 2N7002
R29-R32 = Res_0402: Convert to PCB: yes; Device: Res_0402; Add into BOM: yes; Supplier Footprint: 0402; Value: 20; Name: 20
U6 = MAX3485ECSA+: Add into BOM: yes; Symbol: MAX3485ECSA+; Device: MAX3485ECSA+; LCSC Part Name: MAX3485ECSA+; Supplier Part: C3235169; Manufacturer Part: MAX3485ECSA+; Supplier Footprint: SOIC-8; Datasheet: https://atta.szlcsc.comnull; Supplier: LCSC; Convert to PCB: yes; Name: MAX3485ECSA+
U7 = QMC5883L: Add into BOM: yes; Symbol: QMC5883L; Device: QMC5883L; Supplier Part: C976032; Manufacturer Part: QMC5883L; Supplier Footprint: LGA-16(3x3x0.9); JLCPCB Part Class: Extended Part; Datasheet: https://atta.szlcsc.com/upload/public/pdf/source/20201217/C976032_5B9A2F3901E175046CBA037B1F18A1F2.pdf; Supplier: LCSC; Convert to PCB: yes; Name: QMC5883L
U8 = AHT10: Add into BOM: yes; Symbol: AHT10; Device: AHT10; LCSC Part Name: AHT10; Supplier Part: C368909; Manufacturer Part: AHT10; Supplier Footprint: SMD; JLCPCB Part Class: Extended Part; Datasheet: https://atta.szlcsc.com/upload/public/pdf/source/20190129/C368909_B294364A5189322D50DF5028F78C32FD.pdf; Supplier: LCSC; Convert to PCB: yes; Name: AHT10

## Sheet 6_对外接口.Schdoc
size A4
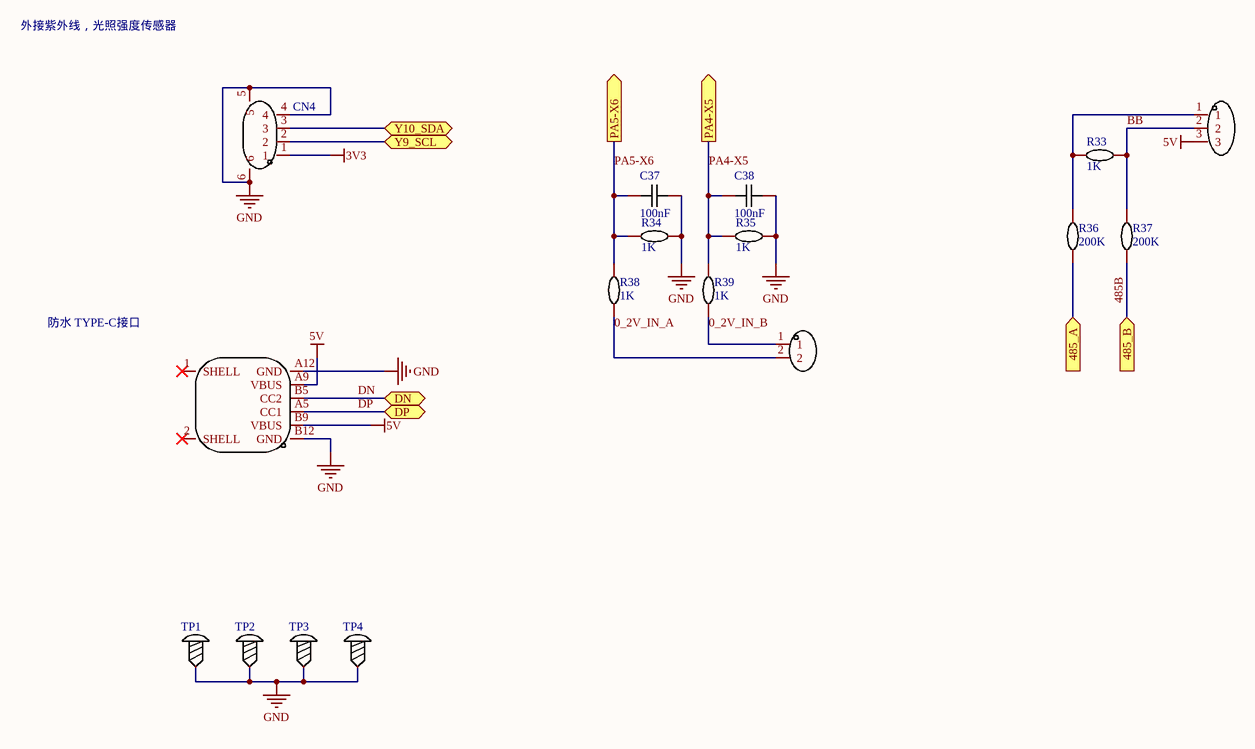
[diagram p5: 6_对外接口.Schdoc]

### Parts
C37  100nF  [0402]
C38  100nF  [0402]
CN4  HX25003-4AWB  [CONN-SMD_4P-P2.50_HX25003-4AWB]  (value not drawn)
CN5  XH-3A  [CONN-TH_XH-3A]  (value not drawn)
CN6  XH-2A  [CONN-TH_2P-P2.50_HCTL_XH-2A-X]  (value not drawn)
R33  1K  [0603R]
R34  1K  [0603R]
R35  1K  [0603R]
R36  200K  [0805]
R37  200K  [0805]
R38  1K  [0603R]
R39  1K  [0603R]
TP1  M3__  [PCBComponent_1 - duplicate]  (value not drawn)
TP2  M3__  [PCBComponent_1 - duplicate]  (value not drawn)
TP3  M3__  [PCBComponent_1 - duplicate]  (value not drawn)
TP4  M3__  [PCBComponent_1 - duplicate]  (value not drawn)
USB2  TYPE-C 6P(040_)  [USB-C-SMD_TYPE-C-6P]  (value not drawn)

### Ports
485_A (in), 485_B (in), DN (bidir), DP (bidir), PA4-X5 (out), PA5-X6 (out), Y9_SCL (bidir), Y10_SDA (bidir)

### Nets
3V3: CN4.1
5V: CN5.3 USB2.A9(VBUS) USB2.B9(VBUS)
GND: C37.2 C38.2 CN4.4 CN4.5 CN4.6 R34.1 R35.1 TP1.1 TP2.1 TP3.1 TP4.1 USB2.A12(GND) USB2.B12(GND)
0_2V_IN_A: CN6.2 R38.1
0_2V_IN_B: CN6.1 R39.1
485_A: R36.1 ; port 485_A
485B: R37.1 ; port 485_B  [project net 485_B]
BB: CN5.2 R33.2 R37.2
DN: USB2.B5(CC2) ; port DN
DP: USB2.A5(CC1) ; port DP
PA4-X5: C38.1 R35.2 R39.2 ; port PA4-X5
PA5-X6: C37.1 R34.2 R38.2 ; port PA5-X6
Y10_SCL: CN4.2 ; port Y9_SCL
Y10_SDA: CN4.3 ; port Y10_SDA
NetCN5_1: CN5.1 R33.1 R36.2

Not connected (* = marked no-connect by the designer): USB2 1(SHELL)* 2(SHELL)*

### Notes on the sheet
- 外接紫外线，光照强度传感器
- 防水 TYPE-C接口

### Library data of the parts
C37 C38 = CAP_0402: Symbol: CapAcitance; Convert to PCB: yes; Device: CAP_0402; Add into BOM: yes; Supplier Footprint: 0402; Value: 100nF; Name: 100nF
CN4 = HX25003-4AWB: Add into BOM: yes; Reference Series: XH; Pitch: 2.5mm; Pins Structure: 1x4P; Number of PINs Per Row: 4; Name: HX25003-4AWB; Symbol: HX25003-4AWB; Device: HX25003-4AWB; Supplier Part: C442363; Manufacturer Part: HX25003-4AWB; Supplier Footprint: SMD,P=2.5mm; JLCPCB Part Class: Extended Part; Datasheet: https://atta.szlcsc.com/upload/public/pdf/source/20191028/C442363_5F1A00A27A9E9A3DE9CAD5B4615D2548.pdf; Supplier: LCSC; Convert to PCB: yes; Number of Rows: 1; Row Spacing: -; Current Rating (Max): -; Operating Temperature Range: -
CN5 = XH-3A: Symbol: XH-3A_C2908601; Add into BOM: yes; Pins Structure: 1x3P; Pitch: 2.5mm; Number of PINs Per Row: 3; Reference Series: XH; Current Rating (Max): 3A; Device: XH-3A; Supplier: LCSC; Supplier Part: C2908601; Manufacturer Part: XH-3A; JLCPCB Part Class: Extended Part; Datasheet: https://atta.szlcsc.com/upload/public/pdf/source/20230711/68D365716984B4AFE576D1D73D61B465.pdf; Convert to PCB: yes; Row Spacing: -; Number of Pins: 3P; Number of Rows: 1
CN6 = XH-2A: Symbol: XH-2A_C2908600; Add into BOM: yes; Pins Structure: 1x2P; Pitch: 2.5mm; Number of PINs Per Row: 2; Reference Series: XH; Current Rating (Max): 3A; Device: XH-2A; Supplier: LCSC; Supplier Part: C2908600; Manufacturer Part: XH-2A; JLCPCB Part Class: Extended Part; Datasheet: https://atta.szlcsc.com/upload/public/pdf/source/20230711/68D365716984B4AFE576D1D73D61B465.pdf; Convert to PCB: yes; Row Spacing: -; Number of Pins: 2P; Number of Rows: 1
R33-R35 R38 R39 = Res_0603: Convert to PCB: yes; Name: 1K; Device: Res_0603; Add into BOM: yes; Supplier Footprint: 0603; Value: 1K
R36 R37 = Res_0805: Convert to PCB: yes; Name: 200K; Device: Res_0805; Add into BOM: yes; Supplier Footprint: 0805; Value: 200K
TP1-TP4 = M3__: Convert to PCB: yes; Add into BOM: yes
USB2 = TYPE-C 6P(040_): Add into BOM: yes; Number of Ports: 1; Current Rating - Power (Max): 3A; Supplier: LCSC; Supplier Part: C2887422; JLCPCB Part Class: Extended Part; Supplier Footprint: SMD; Datasheet: https://atta.szlcsc.com/upload/public/pdf/source/20210820/A6D4675B44FEA528A0512D7C06DEA92E.pdf; Convert to PCB: yes; Connector Type: Type-C; Standard: -; Number of Contacts: 6P

## Sheet 7_5G模块电源.SchDoc
size A4
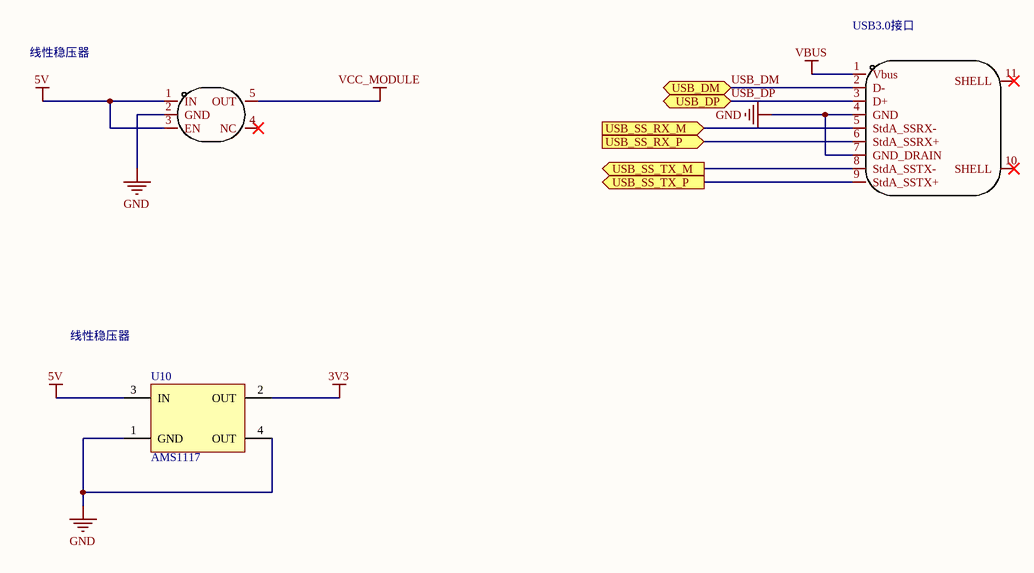
[diagram p6: 7_5G模块电源.SchDoc]

### Parts
U9  TLV70237DBVR  [SOT-23-5_L2.9-W1.6-P0.95-LS2.8-BR]  (value not drawn)
U10  AMS1117  [SOT223_4]
USB3  HC-ST-003-01-J  [USB-3.0-A-TH_HC-ST-003-01-Z]  (value not drawn)

### Ports
USB_DM (bidir), USB_DP (bidir), USB_SS_RX_M (in), USB_SS_RX_P (in), USB_SS_TX_M (out), USB_SS_TX_P (out)

### Nets
3V3: U10.2(OUT)
5V: U9.1(IN) U9.3(EN) U10.3(IN)
GND: U9.2(GND) U10.1(GND) U10.4(OUT) USB3.4(GND) USB3.7(GND_DRAIN)
VBUS: USB3.1(Vbus)
VCC_MODULE: U9.5(OUT)
USB_DM: USB3.2(D-) ; port USB_DM
USB_DP: USB3.3(D+) ; port USB_DP
USB_SS_RX_M: USB3.8(StdA_SSTX-) ; port USB_SS_TX_M
USB_SS_RX_P: USB3.9(StdA_SSTX+) ; port USB_SS_TX_P
USB_SS_TX_M: USB3.5(StdA_SSRX-) ; port USB_SS_RX_M
USB_SS_TX_P: USB3.6(StdA_SSRX+) ; port USB_SS_RX_P

Not connected (* = marked no-connect by the designer): U9 4(NC)*; USB3 10(SHELL)* 11(SHELL)*

### Notes on the sheet
- (near USB3) USB3.0接口
- 线性稳压器

### Library data of the parts
U9 = TLV70237DBVR: Add into BOM: yes; Symbol: TLV70237DBVR; Device: TLV70237DBVR; LCSC Part Name: TLV70237DBVR; Supplier Part: C2877850; Manufacturer Part: TLV70237DBVR; Supplier Footprint: SOT-23-5; JLCPCB Part Class: Extended Part; Supplier: LCSC; Convert to PCB: yes
USB3 = HC-ST-003-01-J: Add into BOM: yes; Connector Type: Type-A; Number of Ports: 1; Number of Contacts: 9P; Current Rating - Power (Max): 1.5A; Symbol: HC-ST-003-01-J; Device: HC-ST-003-01-J; Supplier: LCSC; Supplier Part: C2845330; Manufacturer Part: HC-ST-003-01-J; JLCPCB Part Class: Extended Part; Datasheet: https://atta.szlcsc.com/upload/public/pdf/source/20221116/DADAB294700AAF55209BD8638F95257E.pdf; Convert to PCB: yes; Standard: USB 3.0

## Sheet 8_SD卡电路.SchDoc
size A4
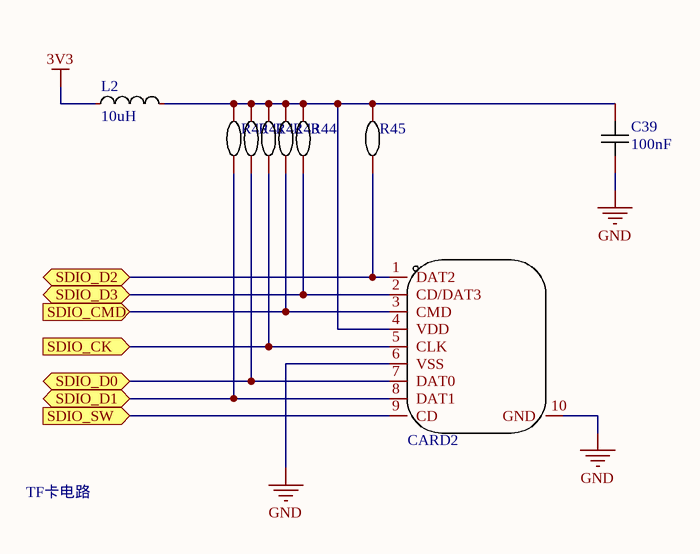
[diagram p7: 8_SD卡电路.SchDoc]

### Parts
C39  100nF  [0603C]
CARD2  TF-02A  [TF-SMD_TF-02]  (value not drawn)
L2  10uH  [L0603]
R40  (no value)  [0402R]
R41  (no value)  [0402R]
R42  (no value)  [0402R]
R43  (no value)  [0402R]
R44  (no value)  [0402R]
R45  (no value)  [0402R]

### Ports
SDIO_CK (in), SDIO_CMD (in), SDIO_D0 (bidir), SDIO_D1 (bidir), SDIO_D2, SDIO_D3 (bidir), SDIO_SW (in)

### Nets
3V3: L2.1
GND: C39.1 CARD2.6(VSS) CARD2.10(GND)
SDIO_CK: CARD2.5(CLK) R42.1 ; port SDIO_CK
SDIO_CMD: CARD2.3(CMD) R43.1 ; port SDIO_CMD
SDIO_D0: CARD2.7(DAT0) R41.1 ; port SDIO_D0
SDIO_D1: CARD2.8(DAT1) R40.1 ; port SDIO_D1
SDIO_D2: CARD2.1(DAT2) R45.1 ; port SDIO_D2
SDIO_D3: CARD2.2(CD/DAT3) R44.1 ; port SDIO_D3
SDIO_SW: CARD2.9(CD) ; port SDIO_SW
NetC39_2: C39.2 CARD2.4(VDD) L2.2 R40.2 R41.2 R42.2 R43.2 R44.2 R45.2

### Notes on the sheet
- TF엥든쨌

### Library data of the parts
C39 = CAP_0603: Symbol: CapAcitance; Convert to PCB: yes; Device: CAP_0603; Add into BOM: yes; Supplier Footprint: 0603; Value: 100nF; Name: 100nF
CARD2 = TF-02A: Symbol: TF-02A_C2889261; Add into BOM: yes; Maximum Body Height: 2mm; Device: TF-02A; Supplier Part: C2889261; Manufacturer Part: TF-02A; Supplier Footprint: SMD; JLCPCB Part Class: Extended Part; Datasheet: https://atta.szlcsc.com/upload/public/pdf/source/20210830/024A9A7E12D3087F16F1466156B6A08F.pdf; Supplier: LCSC; Convert to PCB: yes; Operating Temperature Range: -; Name: TF-02A
L2 = L_0603: as L1 on sheet 2_主控; Device: L_0603; Supplier Footprint: L0603; Convert to PCB: yes; Value: 10uH; Name: 10uH
R40-R45 = RC0402FR-0710KL: as R1 on sheet 2_主控; Device: RC0402FR-0710KL; Supplier Part: C60490; Manufacturer Part: RC0402FR-0710KL; Supplier Footprint: 0402; JLCPCB Part Class: Extended Part; Datasheet: https://atta.szlcsc.com/upload/public/pdf/source/20170606/1496716515432.pdf; Supplier: LCSC; Convert to PCB: yes

## Sheet 9_降压电路.SchDoc
size A3
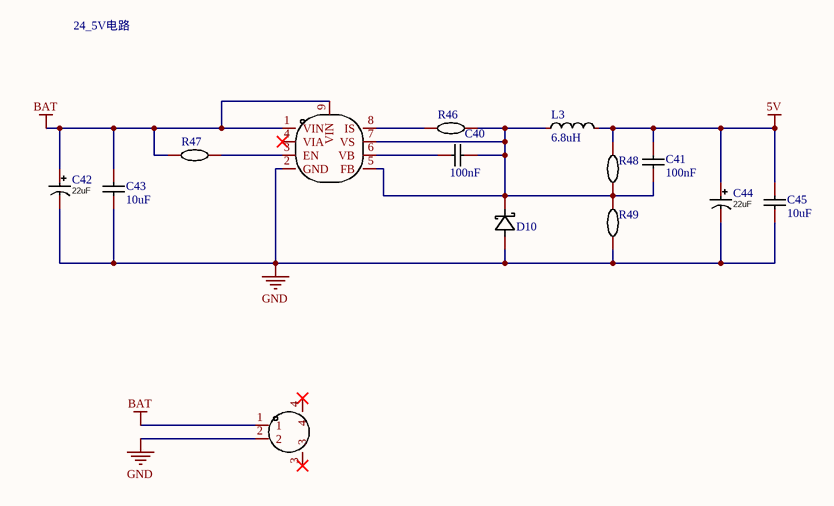
[diagram p8: 9_降压电路.SchDoc]

### Parts
C40  100nF  [0603C]
C41  100nF  [0603C]
C42  22uF  [CAP-SMD_BD6.3-L6.6-W6.6-FD]
C43  10uF  [1206C]
C44  22uF  [CAP-SMD_BD6.3-L6.6-W6.6-FD]
C45  10uF  [1206C]
CN8  XT30PW-M  [CONN-TH_XT30PW-M]  (value not drawn)
D10  SS32  [SMAF_L4.3-W2.5-LS5.0-RD]  (value not drawn)
L3  6.8uH  [IND-SMD_L12.0-W12.0]
R46  0603WAF1002T5E  [0603R]  (value not drawn)
R47  0603WAF1002T5E  [0603R]  (value not drawn)
R48  0603WAF1002T5E  [0603R]  (value not drawn)
R49  0603WAF1002T5E  [0603R]  (value not drawn)
U11  ICW6208  [ESOP-8_L4.9-W3.9-P1.27-LS6.0-TL-EP3.3]  (value not drawn)

### Nets
5V: C41.2 C44.1 C45.2 L3.2 R48.2
BAT: C42.1 C43.2 CN8.1 R47.1 U11.1(VIN) U11.9(VIN)
GND: C42.2 C43.1 C44.2 C45.1 CN8.2 D10.2(A) R49.1 U11.2(GND)
NetC40_1: C40.1 U11.6(VB)
NetC40_2: C40.2 C41.1 D10.1(C) L3.1 R46.2 R48.1 R49.2 U11.5(FB) U11.7(VS)
NetR46_1: R46.1 U11.8(IS)
NetR47_2: R47.2 U11.3(EN)

Not connected (* = marked no-connect by the designer): CN8 3* 4*; U11 4(VIA)*

### Notes on the sheet
- 24_5V电路

### Library data of the parts
C40 C41 = 0603B104K500NT: as C17 on sheet 3_5G模块; Symbol: 100nF; Device: 0603B104K500NT; Supplier: LCSC; Manufacturer Part: 0603B104K500NT; Supplier Part: C30926; JLCPCB Part Class: Extended Part; Add into BOM: yes; Name: 100nF
C42 C44 = CL31A226KAHNNNE: Add into BOM: yes; Temperature Coefficient: X5R; Voltage Rated: 25V; Origin Footprint: CAP-TH_BD4.0-P1.50-D0.8-FD; Device: CL31A226KAHNNNE; Supplier Part: C12891; Manufacturer Part: CL31A226KAHNNNE; Supplier Footprint: 1206; JLCPCB Part Class: Extended Part; Datasheet: https://atta.szlcsc.com/upload/public/pdf/source/20160103/1457707667836.pdf; Supplier: LCSC; Convert to PCB: yes; Symbol: 22uF; Value: 22uF
C43 C45 = CL31A106KBHNNNE: Add into BOM: yes; Voltage Rated: 50V; Temperature Coefficient: X5R; Symbol: CL31A106KBHNNNE; Device: CL31A106KBHNNNE; Supplier Part: C13585; Manufacturer Part: CL31A106KBHNNNE; Supplier Footprint: 1206; JLCPCB Part Class: Basic Part; Datasheet: https://atta.szlcsc.com/upload/public/pdf/source/20160103/1457707668742.pdf; Supplier: LCSC; Convert to PCB: yes; Value: 10uF; Name: 10uF
CN8 = XT30PW-M: Add into BOM: yes; RatedVoltage: DC 500V; RatedCurrent: 15A; RecommendedWireGauge: 16/18/20AWG; specifications: 2pin; Symbol: XT30PW-M; Device: XT30PW-M; Supplier: LCSC; Supplier Part: C431092; Manufacturer Part: XT30PW-M; JLCPCB Part Class: Extended Part; Supplier Footprint: -; Datasheet: https://atta.szlcsc.com/upload/public/pdf/source/20220222/6A9F22F7850E25B33E1BE430ADF8560B.pdf; Convert to PCB: yes; Model: XT30PW-M; Power: -; Output: -; Input: -; Size: -; Interface: -; Colour: -; MaximumCurrent: -; Type1: -; NumberOfUSBHoles: -; MetalMaterial: -; InsulationMaterial: -; FlameRetardantGrade: -; Belt length: -
D10 = SS32: Symbol: SS32_C727059; Add into BOM: yes; Device: SS32; LCSC Part Name: SS32; Supplier Part: C727059; Manufacturer Part: SS32; Supplier Footprint: SMA; JLCPCB Part Class: Extended Part; Datasheet: https://atta.szlcsc.com/upload/public/pdf/source/20200828/C727059_6599B6CAC5F3238B9C33E46794659DBE.pdf; Supplier: LCSC; Convert to PCB: yes; Name: SS32
L3 = SDRH.1207.NLF6R8MT00: Add into BOM: yes; Rated Current: 6.5A; Symbol: SDRH.1207.NLF6R8MT00; Device: SDRH.1207.NLF6R8MT00; Supplier Part: C2942306; Manufacturer Part: SDRH.1207.NLF6R8MT00; Supplier Footprint: SMD,12x12mm; JLCPCB Part Class: Extended Part; Datasheet: https://atta.szlcsc.com/upload/public/pdf/source/20220117/7DF2F95CA0318327D9DA3D2F3A34BD2A.pdf; Supplier: LCSC; Convert to PCB: yes; Value: 6.8uH; Saturation Current (Isat): 6.5A; Name: 6.8uH
R46-R49 = 0603WAF1002T5E: Manufacturer: UniOhm; Resistance: 10K; Convert to PCB: yes; Origin Footprint: R0603; Device: 0603WAF1002T5E; Supplier: LCSC; Manufacturer Part: 0603WAF1002T5E; Supplier Part: C25804; JLCPCB Part Class: Basic Part; Add into BOM: yes
U11 = ICW6208: Add into BOM: yes; Symbol: ICW6208; Device: ICW6208; Supplier: LCSC; Supplier Part: C5448775; Manufacturer Part: ICW6208; JLCPCB Part Class: Extended Part; LCSC Part Name: ICW6208; Supplier Footprint: ESOP-8; Datasheet: https://atta.szlcsc.com/upload/public/pdf/source/20230613/A8AD911CFB7BA22FB46A84D77D648079.pdf; Convert to PCB: yes

## Nets that join several sheets
3V3: 2_主控 (16 pins), 5_传感器 (6 pins), 6_对外接口 (CN4.1), 7_5G模块电源 (U10.2), 8_SD卡电路 (L2.1)
5V: 2_主控 (8 pins), 5_传感器 (C31.2 R30.2 U6.8), 6_对外接口 (CN5.3 USB2.A9 USB2.B9), 7_5G模块电源 (U9.1 U9.3 U10.3), 9_降压电路 (5 pins)
GND: 2_主控 (41 pins), 3_5G模块 (38 pins), 4_SIM卡座电路 (10 pins), 5_传感器 (11 pins), 6_对外接口 (13 pins), 7_5G模块电源 (5 pins), 8_SD卡电路 (C39.1 CARD2.6 CARD2.10), 9_降压电路 (8 pins)
VBUS: 2_主控 (USB1.2 USB1.3 USB1.9 USB1.11), 7_5G模块电源 (USB3.1)
VCC_MODULE: 3_5G模块 (19 pins), 7_5G模块电源 (U9.5)
485_A: 5_传感器 (U6.6), 6_对外接口 (R36.1)
485_B: 5_传感器 (U6.7), 6_对外接口 (R37.1)
DN: 2_主控 (R12.2 USB1.5 USB1.7), 6_对外接口 (USB2.B5)
DP: 2_主控 (R9.2 USB1.6 USB1.8), 6_对外接口 (USB2.A5)
FULL_CARD_POWER_OFF#: 2_主控 (U1.37), 3_5G模块 (CN3.6 U5.6)
PA4-X5: 2_主控 (U1.20), 6_对外接口 (C38.1 R35.2 R39.2)
PA5-X6: 2_主控 (U1.21), 6_对外接口 (C37.1 R34.2 R38.2)
SDIO_CK: 2_主控 (U1.53), 8_SD卡电路 (CARD2.5 R42.1)
SDIO_CMD: 2_主控 (U1.54), 8_SD卡电路 (CARD2.3 R43.1)
SDIO_D0: 2_主控 (U1.39), 8_SD卡电路 (CARD2.7 R41.1)
SDIO_D1: 2_主控 (U1.40), 8_SD卡电路 (CARD2.8 R40.1)
SDIO_D2: 2_主控 (U1.51), 8_SD卡电路 (CARD2.1 R45.1)
SDIO_D3: 2_主控 (R21.2 U1.52), 8_SD卡电路 (CARD2.2 R44.1)
SDIO_SW: 2_主控 (U1.41), 8_SD卡电路 (CARD2.9)
UART4_RX: 2_主控 (U1.15), 5_传感器 (R32.1)
UART4_TX: 2_主控 (U1.14), 5_传感器 (R29.1)
UART_RXD: 2_主控 (U1.16), 3_5G模块 (CN3.62 U5.62)
UART_TXD: 2_主控 (U1.17), 3_5G模块 (CN3.64 U5.64)
USB_DM: 3_5G模块 (CN3.9 D3.2 U5.9), 7_5G模块电源 (USB3.2)
USB_DP: 3_5G模块 (CN3.7 D2.2 U5.7), 7_5G模块电源 (USB3.3)
USB_SS_RX_M: 3_5G模块 (CN3.35 U5.35), 7_5G模块电源 (USB3.8)
USB_SS_RX_P: 3_5G模块 (CN3.37 U5.37), 7_5G模块电源 (USB3.9)
USB_SS_TX_M: 3_5G模块 (CN3.29 U5.29), 7_5G模块电源 (USB3.5)
USB_SS_TX_P: 3_5G模块 (CN3.31 U5.31), 7_5G模块电源 (USB3.6)
USIM1_CLK: 3_5G模块 (CN3.32), 4_SIM卡座电路 (R26.1)
USIM1_DATA: 3_5G模块 (CN3.34 U5.34), 4_SIM卡座电路 (R28.1)
USIM1_DET: 3_5G模块 (CN3.66 U5.66), 4_SIM卡座电路 (CARD1.CD D8.1)
USIM1_RST: 3_5G模块 (CN3.30), 4_SIM卡座电路 (R27.1)
USIM1_VDD: 3_5G模块 (CN3.36 U5.36), 4_SIM卡座电路 (C27.2 CARD1.C1 D6.1 R25.2)
WAKE_UP_OUT: 2_主控 (U1.38), 3_5G模块 (CN3.38 U5.38)
X9_SCL: 2_主控 (R1.1 U1.58), 5_传感器 (U7.1)
X10_SDA: 2_主控 (R2.1 U1.59), 5_传感器 (U7.16)
Y10_SCL: 2_主控 (R4.1 U1.30), 5_传感器 (U8.2), 6_对外接口 (CN4.2)
Y10_SDA: 2_主控 (R3.1 U1.29), 5_传感器 (U8.3), 6_对外接口 (CN4.3)